# EAGLE schematic pwrfet (EAGLE 4.13)

## Sheet 1 of 2
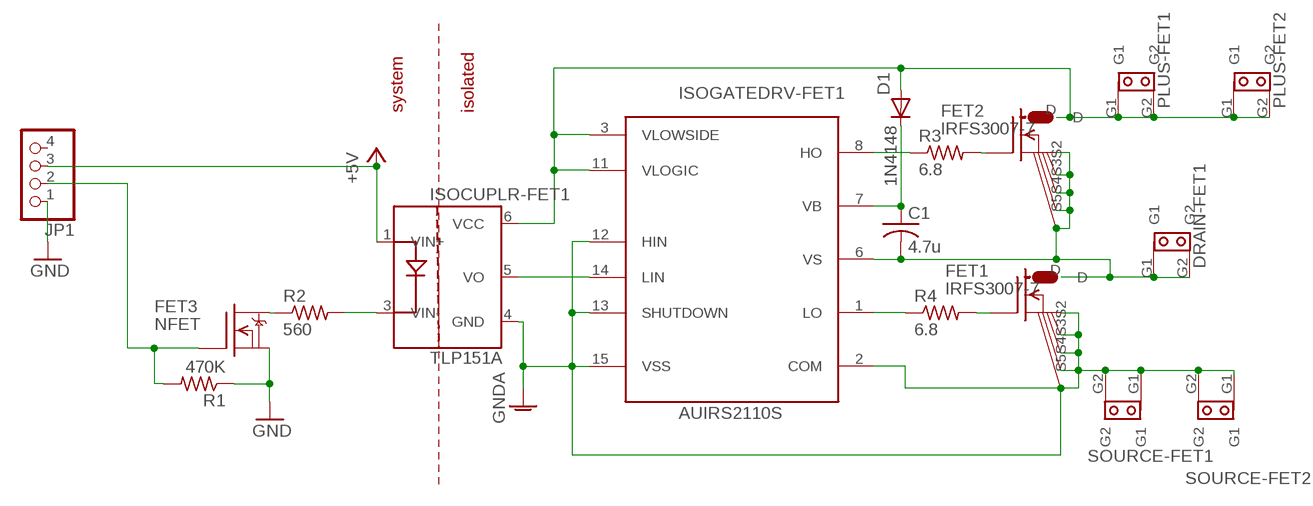
[diagram p0: schematic, sheet 1]

### Parts
C1  4.7u  C-USC0603  [C0603]
D1  1N4148  1N4004_VERT  [DO41-10_VERT]
DRAIN-FET1  SPADE-TAB  [SPADE_TAB]
FET1  IRFS3007-7  [D2PAK-7]
FET2  IRFS3007-7  [D2PAK-7]
FET3  NFET  DMN3404L  [SOT-23]
ISOCUPLR-FET1  TLP151A  [SOT23-5X]
ISOGATEDRV-FET1  AUIRS2110S  [SO-16DW]
JP1  PINHD-1X4  [1X04]
PLUS-FET1  SPADE-TAB  [SPADE_TAB]
PLUS-FET2  SPADE-TAB  [SPADE_TAB]
R1  470K  R-US_R0603  [R0603]
R2  560  R-US_R0603  [R0603]
R3  6.8  R-US_R0603  [R0603]
R4  6.8  R-US_R0603  [R0603]
SOURCE-FET1  SPADE-TAB  [SPADE_TAB]
SOURCE-FET2  SPADE-TAB  [SPADE_TAB]

### Nets
+5V: ISOCUPLR-FET1.1(VIN+) JP1.3
+PWR: D1.A FET2.D ISOCUPLR-FET1.6(VCC) ISOGATEDRV-FET1.3(VLOWSIDE) ISOGATEDRV-FET1.11(VLOGIC) PLUS-FET1.G1 PLUS-FET1.G2 PLUS-FET2.G1 PLUS-FET2.G2
DRAINFET1: C1.2 DRAIN-FET1.G1 DRAIN-FET1.G2 FET1.D FET2.S2(S1) FET2.S3(S2) FET2.S5(S3) FET2.S6(S4) FET2.S7(S5) ISOGATEDRV-FET1.6(VS)
GATE-FET1: FET1.G R4.2
GATEDRV-FET1: ISOGATEDRV-FET1.1(LO) R4.1
GND: FET3.2(S) JP1.1 R1.1
GNDA: FET1.S2(S1) FET1.S3(S2) FET1.S5(S3) FET1.S6(S4) FET1.S7(S5) ISOCUPLR-FET1.4(GND) ISOGATEDRV-FET1.2(COM) ISOGATEDRV-FET1.12(HIN) ISOGATEDRV-FET1.13(SHUTDOWN) ISOGATEDRV-FET1.15(VSS) SOURCE-FET1.G1 SOURCE-FET1.G2 SOURCE-FET2.G1 SOURCE-FET2.G2
HO: ISOGATEDRV-FET1.8(HO) R3.1
ISO-IN-DRAIN-FET1: FET3.3(D) R2.1
ISOINFET1: ISOCUPLR-FET1.3(VIN-) R2.2
ISOSIG-FET1: ISOCUPLR-FET1.5(VO) ISOGATEDRV-FET1.14(LIN)
N$1: FET2.G R3.2
N$2: C1.1 D1.C ISOGATEDRV-FET1.7(VB)
ONOFF-FET1: FET3.1(G) JP1.2 R1.2
Unconnected: JP1.4

### Notes on the sheet
- system | isolated

## Sheet 2 of 2

## Library data of the parts
C1 = rcl:C-US: CAPACITOR, American symbol
D1 = diode:1N4004_VERT
DRAIN-FET1 PLUS-FET1 PLUS-FET2 SOURCE-FET1 SOURCE-FET2 = DEH:SPADE-TAB
FET1 FET2 = transistor-fet:IRFS3007-7
FET3 = transistor-fet:DMN3404L
ISOCUPLR-FET1 = texas:TLP151A
ISOGATEDRV-FET1 = texas:AUIRS2110S
JP1 = pinhead:PINHD-1X4: PIN HEADER
R1-R4 = rcl:R-US_: RESISTOR, American symbol

## Net classes
0 default: width 0.406 mm, clearance 0.711 mm